# EAGLE design final_project_schem (EAGLE 9.6.2)
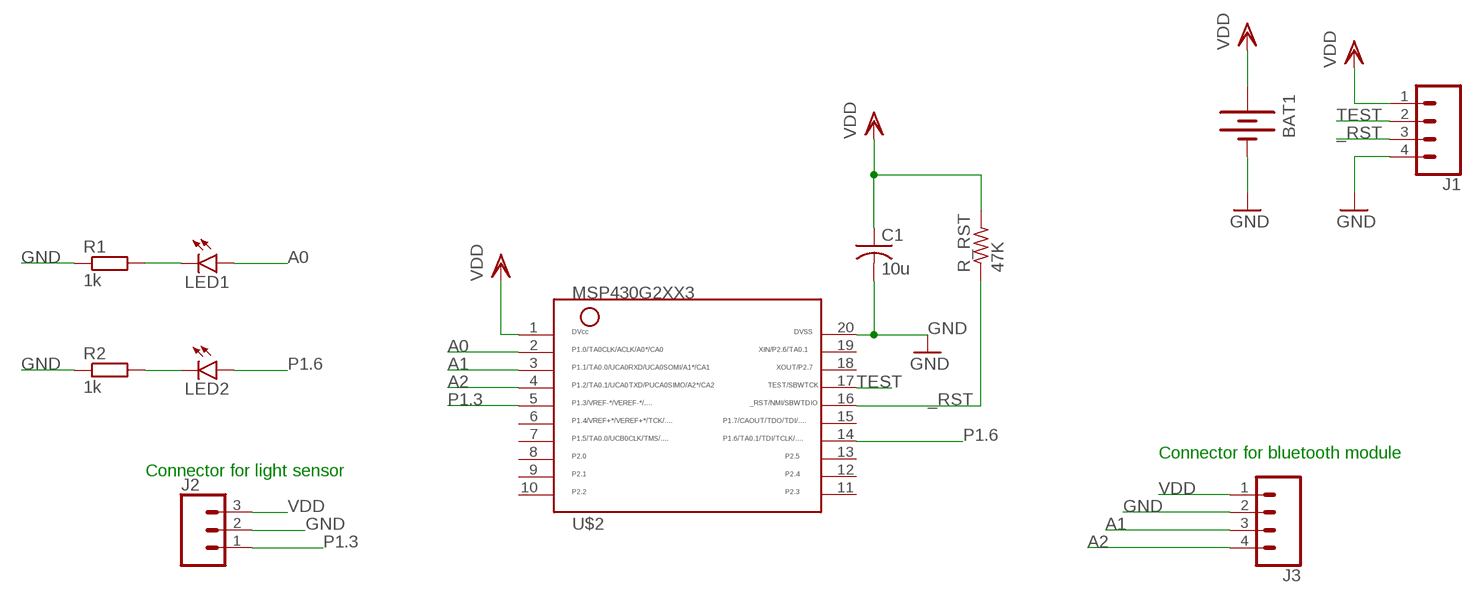
[diagram p0: schematic, sheet 1]

## Parts
BAT1  BATTERYBU2032SM  [BU2032SM]
C1  10u  C-USC1206  [C1206]
J1  CONN_04LOCK  [1X04_LOCK]
J2  CONN_03LOCK  [1X03_LOCK]
J3  CONN_04LOCK  [1X04_LOCK]
LED1  LEDCHIPLED_0805  [CHIPLED_0805]
LED2  LEDCHIPLED_0805  [CHIPLED_0805]
R1  1k  R-EU_R0603  [R0603]
R2  1k  R-EU_R0603  [R0603]
R_RST  47K  R-US_R1206  [R1206]
U$2  MSP430G2XX3TSSOP  [PW20]

## Nets
_RST: J1.3 R_RST.1 U$2.16
A0: LED1.A U$2.2
A1: J3.3 U$2.3
A2: J3.4 U$2.4
GND: BAT1.P$2(-) C1.2 J1.4 J2.2 J3.2 R1.1 R2.1 U$2.20
N$4: LED1.C R1.2
N$5: LED2.C R2.2
P1.3: J2.1 U$2.5
P1.6: LED2.A U$2.14
TEST: J1.2 U$2.17
VDD: BAT1.P$1(+) C1.1 J1.1 J2.3 J3.1 R_RST.2 U$2.1
Unconnected: U$2.6 U$2.7 U$2.8 U$2.9 U$2.10 U$2.11 U$2.12 U$2.13 U$2.15 U$2.18 U$2.19

## Notes on the sheet
- Connector for bluetooth module
- Connector for light sensor

## Library data of the parts
BAT1 = ELEC327:BATTERY: Battery Holders Various common sizes : AA, AAA, 20mm coin cell and 12mm coin cell. 20MM_4LEGS, BATT-10373
C1 = rcl:C-US: CAPACITOR, American symbol; SPICEPREFIX: C
J1 J3 = SparkFun-Connectors:CONN_04: Multi connection point. Often used as Generic Header-pin footprint for 0.1 inch spaced/style header connections On any of the 0.1 inch spaced packages, you can populate with these: Break Away Headers - Straight <https://www.sparkfun.com/products/116> (PRT-00116) Break Away Male Headers - Right Angle <https://www.sparkfun.com/products/553> (PRT-00553) Female Headers <https://www.sparkfun.com/products/115> (PRT-00115) Break Away Headers - Machine Pin <https://www.sparkfun.com/products/117> (PRT-00117) Break Away Female Headers - Swiss Machine Pin <https://www.sparkfun.com/products/743> (PRT-00743) For SCREWTERMINALS and SPRING TERMINALS visit here: Screw Terimnals on SparkFun.com <https://www.sparkfun.com/search/results?term=Screw+Terminals> (5mm/3.5mm/2.54mm spacing) This device is also useful as a general connection point to wire up your design to another part of your project. Our various solder wires solder well into these plated through hole pads. Hook-Up Wire - Assortment (Stranded, 22 AWG) <https://www.sparkfun.com/products/11375> (PRT-11375) Hook-Up Wire - Assortment (Solid Core, 22 AWG) <https://www.sparkfun.com/products/11367> (PRT-11367) View the entire wire category on our website here <https://www.sparkfun.com/categories/141> Special notes: Molex polarized connector foot print use with SKU : PRT-08231 with associated crimp pins and housings. 1MM SMD Version SKU: PRT-10208; PROD_ID: CONN-09696
J2 = SparkFun-Connectors:CONN_03: Multi connection point. Often used as Generic Header-pin footprint for 0.1 inch spaced/style header connections On any of the 0.1 inch spaced packages, you can populate with these: Break Away Headers - Straight <https://www.sparkfun.com/products/116> (PRT-00116) Break Away Male Headers - Right Angle <https://www.sparkfun.com/products/553> (PRT-00553) Female Headers <https://www.sparkfun.com/products/115> (PRT-00115) Break Away Headers - Machine Pin <https://www.sparkfun.com/products/117> (PRT-00117) Break Away Female Headers - Swiss Machine Pin <https://www.sparkfun.com/products/743> (PRT-00743) Stackable Header - 3 Pin (Female, 0.1") <https://www.sparkfun.com/products/13875> (PRT-13875) For SCREWTERMINALS and SPRING TERMINALS visit here: Screw Terimnals on SparkFun.com <https://www.sparkfun.com/search/results?term=Screw+Terminals> (5mm/3.5mm/2.54mm spacing) This device is also useful as a general connection point to wire up your design to another part of your project. Our various solder wires solder well into these plated through hole pads. Hook-Up Wire - Assortment (Stranded, 22 AWG) <https://www.sparkfun.com/products/11375> (PRT-11375) Hook-Up Wire - Assortment (Solid Core, 22 AWG) <https://www.sparkfun.com/products/11367> (PRT-11367) View the entire wire category on our website here <https://www.sparkfun.com/categories/141> Special notes: Molex polarized connector foot print use with SKU : PRT-08232 with associated crimp pins and housings.
LED1 LED2 = led:LED: LED OSRAM: - CHIPLED LG R971, LG N971, LY N971, LG Q971, LY Q971, LO R971, LY R971 LH N974, LH R974 LS Q976, LO Q976, LY Q976 LO Q996 - Hyper CHIPLED LW Q18S LB Q993, LB Q99A, LB R99A - SideLED LS A670, LO A670, LY A670, LG A670, LP A670 LB A673, LV A673, LT A673, LW A673 LH A674 LY A675 LS A676, LA A676, LO A676, LY A676, LW A676 LS A679, LY A679, LG A679 - Hyper Micro SIDELED® LS Y876, LA Y876, LO Y876, LY Y876 LT Y87S - SmartLED LW L88C, LW L88S LB L89C, LB L89S, LG L890 LS L89K, LO L89K, LY L89K LS L896, LA L896, LO L896, LY L896 - TOPLED LS T670, LO T670, LY T670, LG T670, LP T670 LSG T670, LSP T670, LSY T670, LOP T670, LYG T670 LG T671, LOG T671, LSG T671 LB T673, LV T673, LT T673, LW T673 LH T674 LS T676, LA T676, LO T676, LY T676, LB T676, LH T676, LSB T676, LW T676 LB T67C, LV T67C, LT T67C, LS T67K, LO T67K, LY T67K, LW E67C LS E67B, LA E67B, LO E67B, LY E67B, LB E67C, LV E67C, LT E67C LW T67C LS T679, LY T679, LG T679 LS T770, LO T770, LY T770, LG T770, LP T770 LB T773, LV T773, LT T773, LW T773 LH T774 LS E675, LA E675, LY E675, LS T675 LS T776, LA T776, LO T776, LY T776, LB T776 LHGB T686 LT T68C, LB T68C - Hyper Mini TOPLED® LB M676 - Mini TOPLED Santana® LG M470 LS M47K, LO M47K, LY M47K Source: http://www.osram.convergy.de LUXEON: - LUMILED® LXK2-PW12-R00, LXK2-PW12-S00, LXK2-PW14-U00, LXK2-PW14-V00 LXK2-PM12-R00, LXK2-PM12-S00, LXK2-PM14-U00 LXK2-PE12-Q00, LXK2-PE12-R00, LXK2-PE12-S00, LXK2-PE14-T00, LXK2-PE14-U00 LXK2-PB12-K00, LXK2-PB12-L00, LXK2-PB12-M00, LXK2-PB14-N00, LXK2-PB14-P00, LXK2-PB14-Q00 LXK2-PR12-L00, LXK2-PR12-M00, LXK2-PR14-Q00, LXK2-PR14-R00 LXK2-PD12-Q00, LXK2-PD12-R00, LXK2-PD12-S00 LXK2-PH12-R00, LXK2-PH12-S00 LXK2-PL12-P00, LXK2-PL12-Q00, LXK2-PL12-R00 Source: www.luxeon.com KINGBRIGHT: KA-3528ASYC Source: www.kingbright.com
R1 R2 = rcl:R-EU_: RESISTOR, European symbol; SPICEPREFIX: R
R_RST = resistor:R-US_: RESISTOR, American symbol
U$2 = ELEC327:MSP430G2XX3: MSP430G2XX3 PDIP (N) 20 Pin Package

## Board
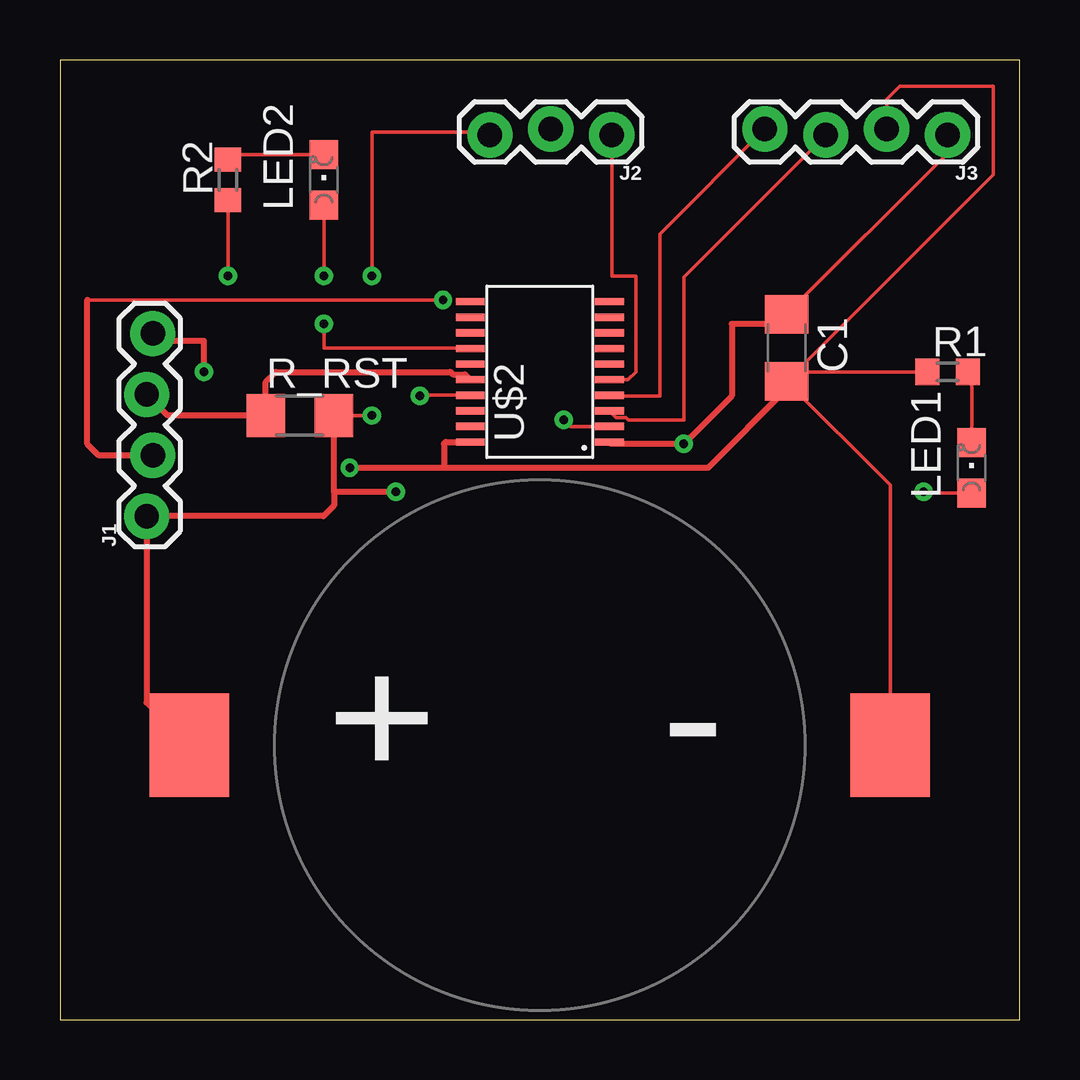
[diagram p1: board, top side]
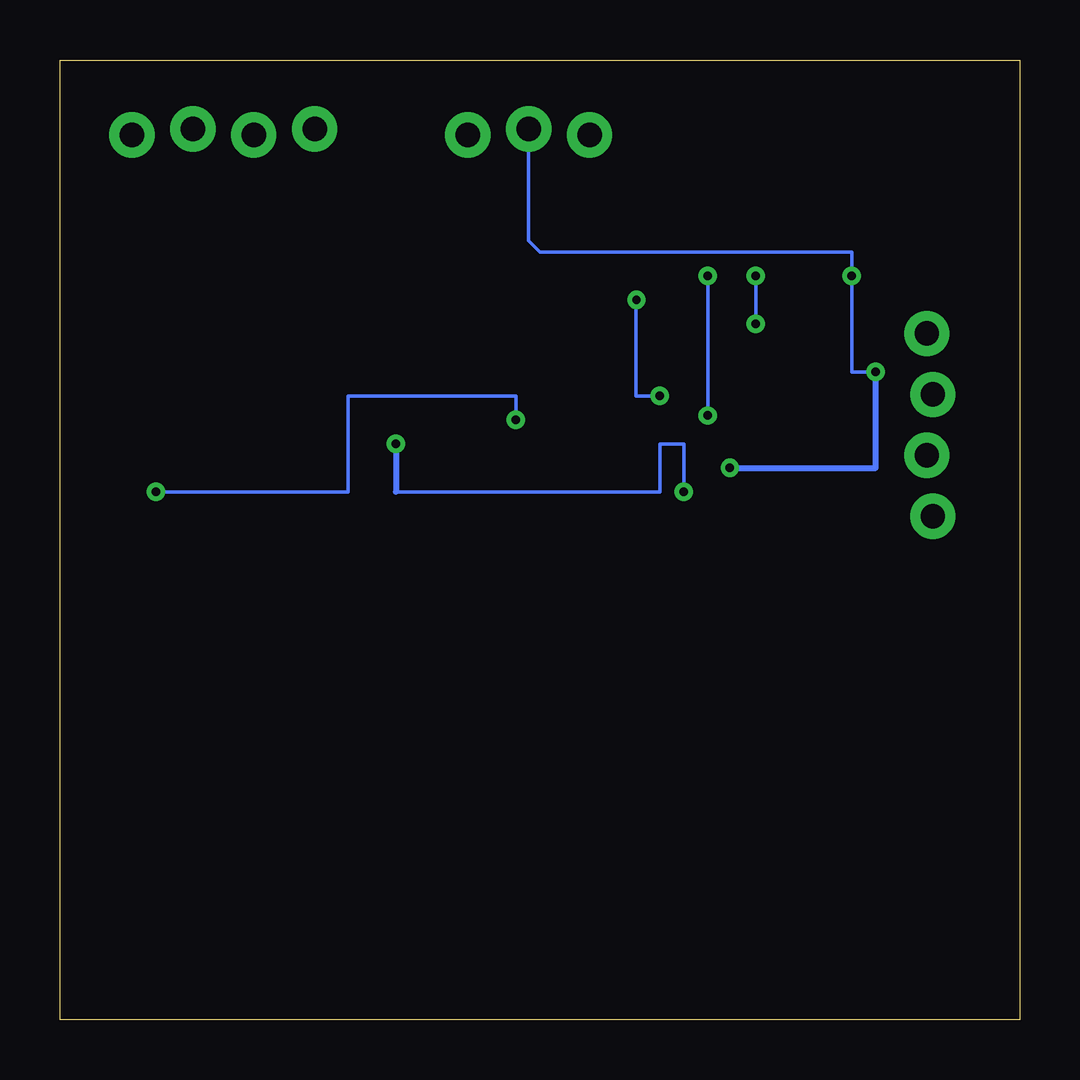
[diagram p2: board, bottom side, seen from below]

Size 40 x 40 mm. Coordinates in mm from the lower left corner, seen from the top.
Outline: 0,0 40,0 40,40 0,40 0,0
Copper layers (1*16): Top 0.035mm / dielectric 1.5mm / Bottom 0.035mm
Design rules "default": minimum track width 6mil, minimum drill 0.35mm, track to track 6mil, track to pad 6mil, pad to pad 6mil, via to via 6mil, smd to smd 6mil, copper to edge 40mil, drill to drill 6mil, minimum pad ring 10mil, minimum via ring 8mil, stop-mask expansion 4mil, vias tented up to drill 0mil, thermal gap 10mil

### Footprints (pad centres in the part's own frame; a part is rotated, then mirrored left to right if it is on the bottom)
BU2032SM = smd 3.302 x 4.318: P$1 -14.605,0; P$2 14.605,0
C1206 = smd 1.6 x 1.8: 1 -1.4,0; 2 1.4,0
1X04_LOCK = drill 1.016 pad 1.88: 1 0,0.127; 2 2.54,-0.127; 3 5.08,0.127; 4 7.62,-0.127
1X03_LOCK = drill 1.016 pad 1.88: 1 0,0.127; 2 2.54,-0.127; 3 5.08,0.127
CHIPLED_0805 = smd 1.2 x 1.2: A 0,-1.05; C 0,1.05
R0603 = smd 1 x 1.1: 1 -0.85,0; 2 0.85,0
R1206 = smd 1.6 x 1.803: 1 -1.422,0; 2 1.422,0
PW20 = smd 0.3 x 1.2: 1 -2.925,-2.9; 2 -2.275,-2.9; 3 -1.625,-2.9; 4 -0.975,-2.9; 5 -0.325,-2.9; 6 0.325,-2.9; 7 0.975,-2.9; 8 1.625,-2.9; 9 2.275,-2.9; 10 2.925,-2.9; 11 2.925,2.9; 12 2.275,2.9; 13 1.625,2.9; 14 0.975,2.9; 15 0.325,2.9; 16 -0.325,2.9; 17 -0.975,2.9; 18 -1.625,2.9; 19 -2.275,2.9; 20 -2.925,2.9

### Placement (x,y rotation side)
BAT1  20,11.43 0 top
C1  30.29,28 270 top
J1  3.74,20.98 90 top
J2  23,37 180 top
J3  37,37 180 top
LED1  38,23 0 top
LED2  11,35 0 top
R1  37,27 0 top
R2  7,35 90 top
R_RST  10,25.18 0 top
U$2  20,27 90 top

### Tracks (layer width: path | path; a pad name or v marks a point on that pad's centre or on a via)
_RST
  Top 0.254: J1.3 4.49,25.18 R_RST.1 8.58,26.58 9,27 16.28,27 16.38,26.9 16.88,26.9 U$2.16
A0  (via drill 0.35)
  Top 0.152: LED1.A 36.05,21.95 v36,22 | U$2.2 21.27,24.73 v21,25
  Bottom 0.152: v36,22 28,22 28,26 21,26 v21,25
A1
  Top 0.152: J3.3 26,30.95 26,25 23.7,25 23.59,25.1 23.17,25.1 U$2.3
A2
  Top 0.152: J3.4 25,32.75 25,26 22.93,26 U$2.4
GND  (via drill 0.35)
  Top 0.152: C1.2 34.6,22.29 34.6,12.39 | C1.2 38.91,35.22 38.91,38.91 35,38.91 34.46,38.37 J3.2 | R2.1 v7,31 | C1.2 30.69,27 R1.1
  Top 0.254: C1.2 30.29,26.29 27,23 16,23 | 16,23 16,24 16.07,24.07 U$2.20 | 34.6,12.39 BAT1.P$2 | J1.4 4.18,28.29 6,28.29 v6,27 | 16,23 v12.08,23
  Bottom 0.152: v6,27 7,27 v7,31 7,32 20,32 20.46,32.46 J2.2
  Bottom 0.254: v12.08,23 6,23 v6,27
N$4
  Top 0.152: R1.2 38,26.85 LED1.C
N$5
  Top 0.152: R2.2 7.2,36.05 LED2.C
P1.3
  Top 0.152: J2.1 23,31 24,31 24,27 23.68,26.68 U$2.5
P1.6  (via drill 0.35)
  Top 0.152: U$2.14 17.07,28 11,28 v11,29 | v11,31 LED2.A
  Bottom 0.152: v11,29 v11,31
TEST  (via drill 0.35)
  Top 0.152: v15,26 15.03,26.02 U$2.17 | 1.14,30 v15.97,30
  Top 0.254: J1.2 1.62,23.52 1.14,24 1.14,30
  Bottom 0.152: v15,26 16,26 16,29.97 v15.97,30
VDD  (via drill 0.35)
  Top 0.152: C1.1 37,36.11 J3.1 | R_RST.2 v13,25.18 | v13,31 13,37 17.79,37 J2.3
  Top 0.254: BAT1.P$1 3.61,13.21 J1.1 10.98,20.98 11.42,21.42 11.42,22 | 11.42,22 R_RST.2 | v14,22 11.42,22 | 30.89,30 C1.1 29.89,29 28,29 28,26 v26,24 22.98,24 U$2.1
  Bottom 0.152: v14,22 14,24 15,24 15,22 26,22 | v13,25.18 v13,31
  Bottom 0.254: v26,24 26,22